# EAGLE design new-display (EAGLE 9.5.2)
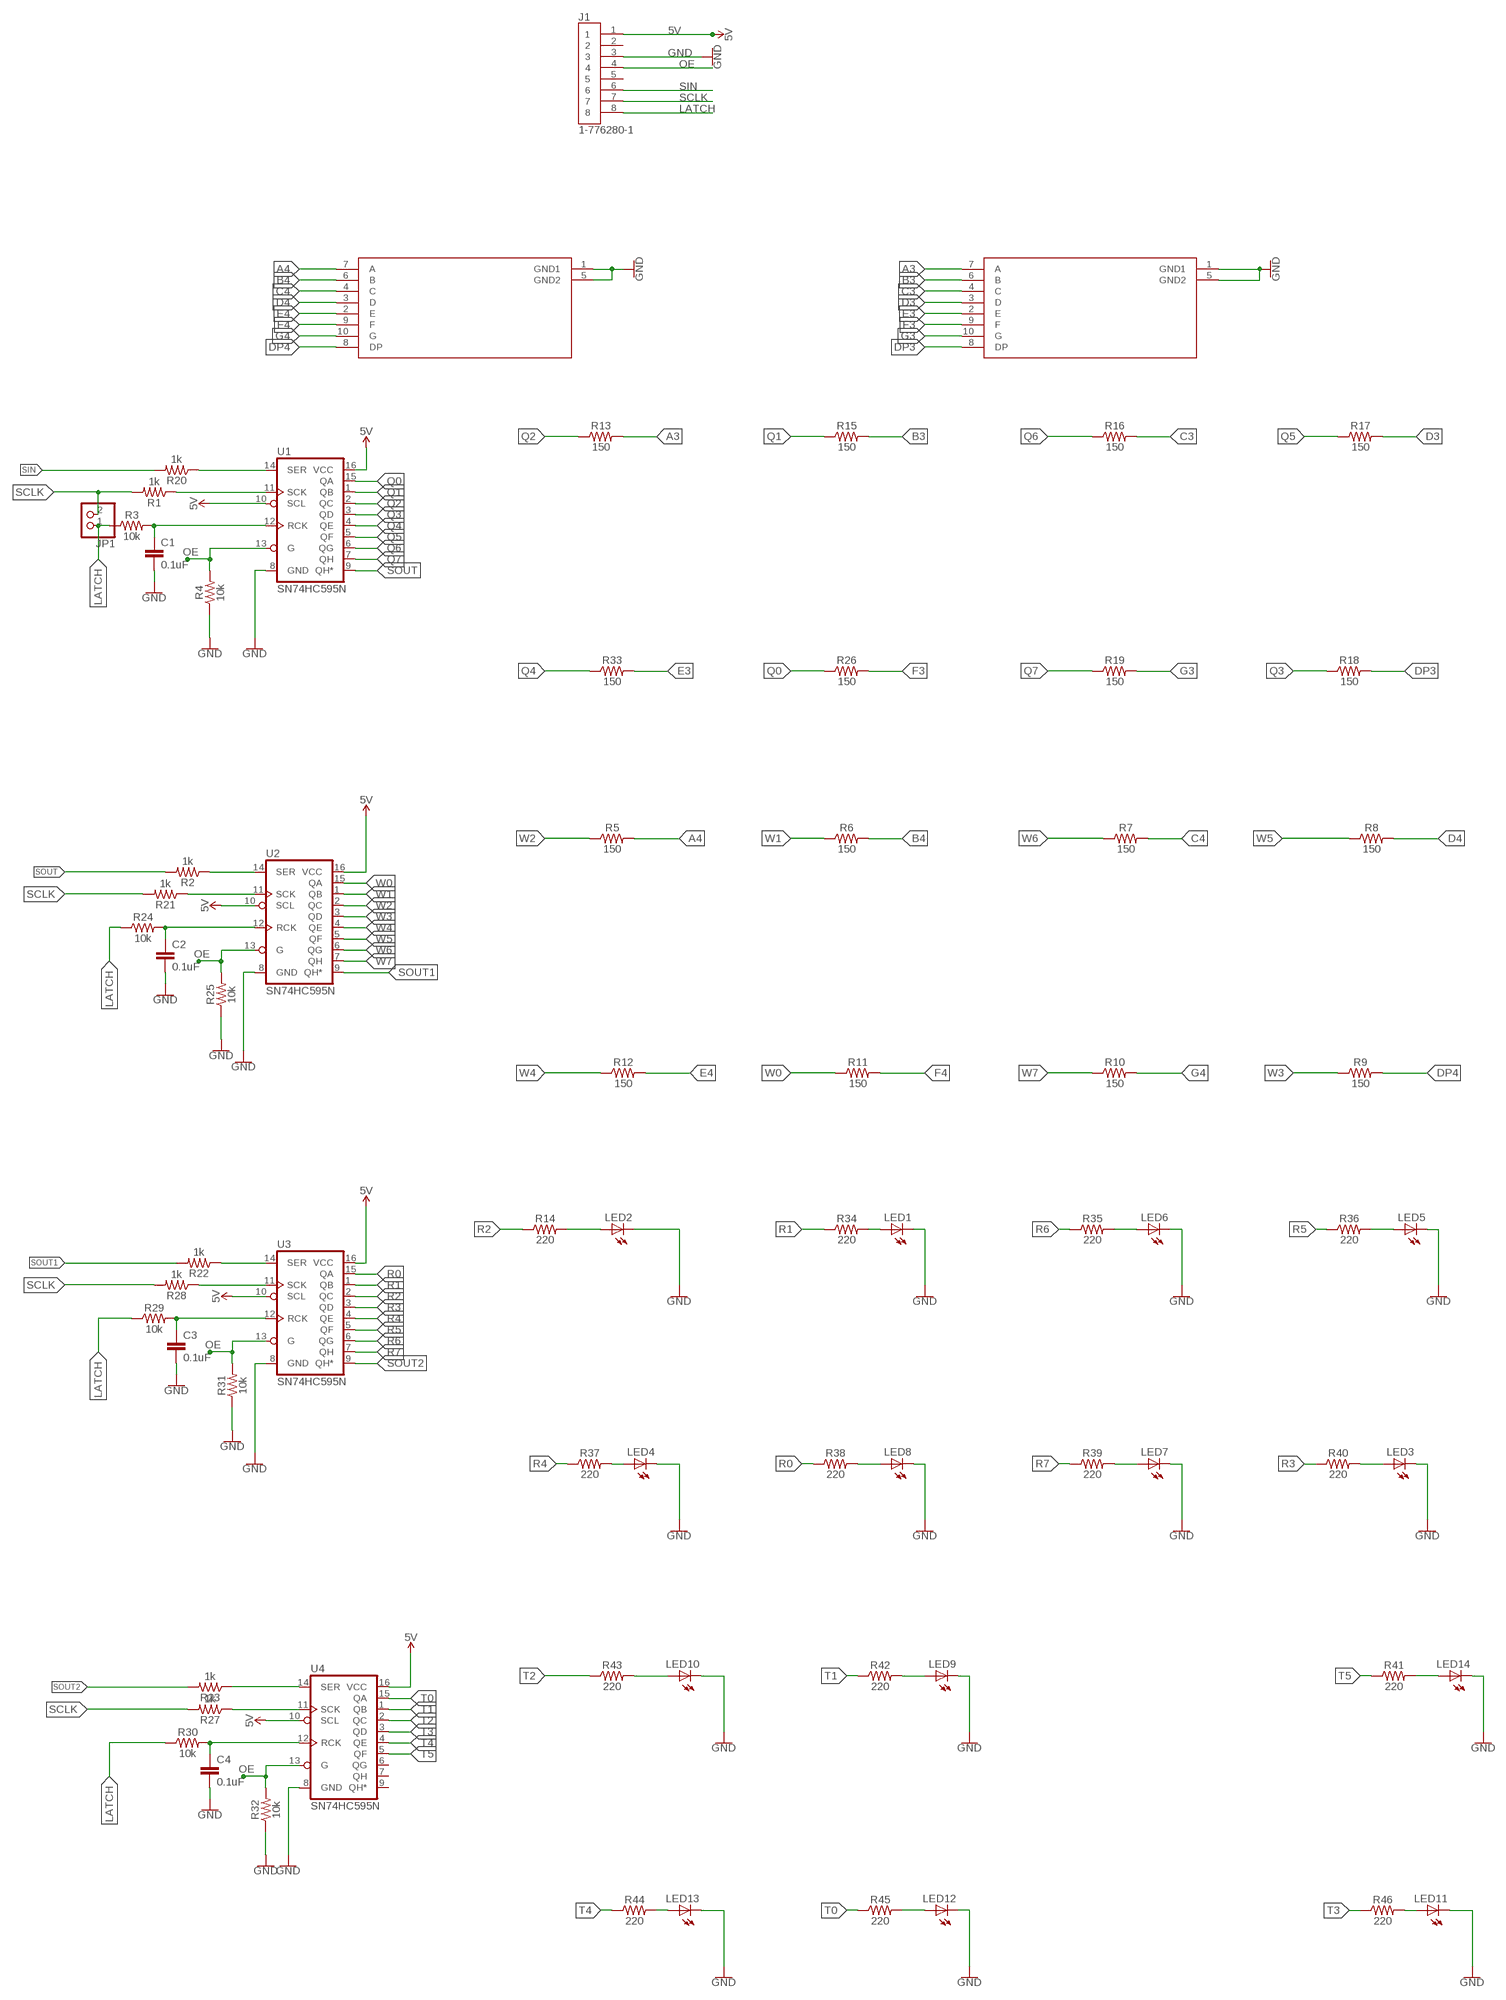
[diagram p0: schematic, sheet 1]

## Parts
C1  0.1uF  22PF-PTH-2.54MM-200V-5%  [CAP-PTH-2.54]
C2  0.1uF  22PF-PTH-2.54MM-200V-5%  [CAP-PTH-2.54]
C3  0.1uF  22PF-PTH-2.54MM-200V-5%  [CAP-PTH-2.54]
C4  0.1uF  22PF-PTH-2.54MM-200V-5%  [CAP-PTH-2.54]
J1  1-776280-1  [TE_1-776280-1]
JP1  PINHD-1X2  [1X02]
LED1  LED5MM  [LED5MM]
LED2  LED5MM  [LED5MM]
LED3  LED5MM  [LED5MM]
LED4  LED5MM  [LED5MM]
LED5  LED5MM  [LED5MM]
LED6  LED5MM  [LED5MM]
LED7  LED5MM  [LED5MM]
LED8  LED5MM  [LED5MM]
LED9  LED5MM  [LED5MM]
LED10  LED5MM  [LED5MM]
LED11  LED5MM  [LED5MM]
LED12  LED5MM  [LED5MM]
LED13  LED5MM  [LED5MM]
LED14  LED5MM  [LED5MM]
R1  1k  1KOHM-HORIZ-1/4W-5%  [AXIAL-0.3]
R2  1k  1KOHM-HORIZ-1/4W-5%  [AXIAL-0.3]
R3  10k  10KOHM-HORIZ-1/4W-5%  [AXIAL-0.3]
R4  10k  10KOHM-HORIZ-1/4W-5%  [AXIAL-0.3]
R5  150  10KOHM-HORIZ-1/4W-5%  [AXIAL-0.3]
R6  150  10KOHM-HORIZ-1/4W-5%  [AXIAL-0.3]
R7  150  10KOHM-HORIZ-1/4W-5%  [AXIAL-0.3]
R8  150  10KOHM-HORIZ-1/4W-5%  [AXIAL-0.3]
R9  150  10KOHM-HORIZ-1/4W-5%  [AXIAL-0.3]
R10  150  10KOHM-HORIZ-1/4W-5%  [AXIAL-0.3]
R11  150  10KOHM-HORIZ-1/4W-5%  [AXIAL-0.3]
R12  150  10KOHM-HORIZ-1/4W-5%  [AXIAL-0.3]
R13  150  10KOHM-HORIZ-1/4W-5%  [AXIAL-0.3]
R14  220  10KOHM-HORIZ-1/4W-5%  [AXIAL-0.3]
R15  150  10KOHM-HORIZ-1/4W-5%  [AXIAL-0.3]
R16  150  10KOHM-HORIZ-1/4W-5%  [AXIAL-0.3]
R17  150  10KOHM-HORIZ-1/4W-5%  [AXIAL-0.3]
R18  150  10KOHM-HORIZ-1/4W-5%  [AXIAL-0.3]
R19  150  10KOHM-HORIZ-1/4W-5%  [AXIAL-0.3]
R20  1k  1KOHM-HORIZ-1/4W-5%  [AXIAL-0.3]
R21  1k  1KOHM-HORIZ-1/4W-5%  [AXIAL-0.3]
R22  1k  1KOHM-HORIZ-1/4W-5%  [AXIAL-0.3]
R23  1k  1KOHM-HORIZ-1/4W-5%  [AXIAL-0.3]
R24  10k  10KOHM-HORIZ-1/4W-5%  [AXIAL-0.3]
R25  10k  10KOHM-HORIZ-1/4W-5%  [AXIAL-0.3]
R26  150  10KOHM-HORIZ-1/4W-5%  [AXIAL-0.3]
R27  1k  1KOHM-HORIZ-1/4W-5%  [AXIAL-0.3]
R28  1k  1KOHM-HORIZ-1/4W-5%  [AXIAL-0.3]
R29  10k  10KOHM-HORIZ-1/4W-5%  [AXIAL-0.3]
R30  10k  10KOHM-HORIZ-1/4W-5%  [AXIAL-0.3]
R31  10k  10KOHM-HORIZ-1/4W-5%  [AXIAL-0.3]
R32  10k  10KOHM-HORIZ-1/4W-5%  [AXIAL-0.3]
R33  150  10KOHM-HORIZ-1/4W-5%  [AXIAL-0.3]
R34  220  10KOHM-HORIZ-1/4W-5%  [AXIAL-0.3]
R35  220  10KOHM-HORIZ-1/4W-5%  [AXIAL-0.3]
R36  220  10KOHM-HORIZ-1/4W-5%  [AXIAL-0.3]
R37  220  10KOHM-HORIZ-1/4W-5%  [AXIAL-0.3]
R38  220  10KOHM-HORIZ-1/4W-5%  [AXIAL-0.3]
R39  220  10KOHM-HORIZ-1/4W-5%  [AXIAL-0.3]
R40  220  10KOHM-HORIZ-1/4W-5%  [AXIAL-0.3]
R41  220  10KOHM-HORIZ-1/4W-5%  [AXIAL-0.3]
R42  220  10KOHM-HORIZ-1/4W-5%  [AXIAL-0.3]
R43  220  10KOHM-HORIZ-1/4W-5%  [AXIAL-0.3]
R44  220  10KOHM-HORIZ-1/4W-5%  [AXIAL-0.3]
R45  220  10KOHM-HORIZ-1/4W-5%  [AXIAL-0.3]
R46  220  10KOHM-HORIZ-1/4W-5%  [AXIAL-0.3]
U1  SN74HC595N  74HC595N  [DIP16]
U2  SN74HC595N  74HC595N  [DIP16]
U3  SN74HC595N  74HC595N  [DIP16]
U4  SN74HC595N  74HC595N  [DIP16]
U$1  DISPLAY1.2  [1.2INCH]
U$2  DISPLAY1.2  [1.2INCH]

## Nets
5V: J1.1 U1.10(SCL) U1.16(VCC) U2.10(SCL) U2.16(VCC) U3.10(SCL) U3.16(VCC) U4.10(SCL) U4.16(VCC)
A3: R13.P$2 U$1.7(A)
A4: R5.P$2 U$2.7(A)
B3: R15.P$2 U$1.6(B)
B4: R6.P$2 U$2.6(B)
C3: R16.P$2 U$1.4(C)
C4: R7.P$2 U$2.4(C)
D3: R17.P$2 U$1.3(D)
D4: R8.P$2 U$2.3(D)
DP3: R18.P$2 U$1.8(DP)
DP4: R9.P$2 U$2.8(DP)
E3: R33.P$2 U$1.2(E)
E4: R12.P$2 U$2.2(E)
F3: R26.P$2 U$1.9(F)
F4: R11.P$2 U$2.9(F)
G3: R19.P$2 U$1.10(G)
G4: R10.P$2 U$2.10(G)
GND: C1.2 C2.2 C3.2 C4.2 J1.3 LED1.K(C) LED2.K(C) LED3.K(C) LED4.K(C) LED5.K(C) LED6.K(C) LED7.K(C) LED8.K(C) LED9.K(C) LED10.K(C) LED11.K(C) LED12.K(C) LED13.K(C) LED14.K(C) R4.P$1 R25.P$1 R31.P$1 R32.P$1 U1.8(GND) U2.8(GND) U3.8(GND) U4.8(GND) U$1.1(GND1) U$1.5(GND2) U$2.1(GND1) U$2.5(GND2)
LATCH: J1.8 JP1.1 R3.P$1 R24.P$1 R29.P$1 R30.P$1
N$1: R20.P$1 U1.14(SER)
N$2: R1.P$1 U1.11(SCK)
N$5: C1.1 R3.P$2 U1.12(RCK)
N$6: R2.P$1 U2.14(SER)
N$10: R21.P$1 U2.11(SCK)
N$18: C2.1 R24.P$2 U2.12(RCK)
N$32: LED4.A R37.P$2
N$33: LED8.A R38.P$2
N$34: LED7.A R39.P$2
N$35: LED3.A R40.P$2
N$36: LED5.A R36.P$2
N$37: LED6.A R35.P$2
N$38: LED1.A R34.P$2
N$39: LED2.A R14.P$2
N$40: LED10.A R43.P$2
N$41: R22.P$1 U3.14(SER)
N$42: R28.P$1 U3.11(SCK)
N$43: C3.1 R29.P$2 U3.12(RCK)
N$44: LED9.A R42.P$2
N$45: LED11.A R46.P$2
N$46: LED14.A R41.P$2
N$47: LED12.A R45.P$2
N$52: R23.P$1 U4.14(SER)
N$53: R27.P$1 U4.11(SCK)
N$54: C4.1 R30.P$2 U4.12(RCK)
N$58: LED13.A R44.P$2
OE: J1.4 R4.P$2 R25.P$2 R31.P$2 R32.P$2 U1.13(G) U2.13(G) U3.13(G) U4.13(G)
Q0: R26.P$1 U1.15(QA)
Q1: R15.P$1 U1.1(QB)
Q2: R13.P$1 U1.2(QC)
Q3: R18.P$1 U1.3(QD)
Q4: R33.P$1 U1.4(QE)
Q5: R17.P$1 U1.5(QF)
Q6: R16.P$1 U1.6(QG)
Q7: R19.P$1 U1.7(QH)
R0: R38.P$1 U3.15(QA)
R1: R34.P$1 U3.1(QB)
R2: R14.P$1 U3.2(QC)
R3: R40.P$1 U3.3(QD)
R4: R37.P$1 U3.4(QE)
R5: R36.P$1 U3.5(QF)
R6: R35.P$1 U3.6(QG)
R7: R39.P$1 U3.7(QH)
SCLK: J1.7 JP1.2 R1.P$2 R21.P$2 R27.P$2 R28.P$2
SIN: J1.6 R20.P$2
SOUT: R2.P$2 U1.9(QH*)
SOUT1: R22.P$2 U2.9(QH*)
SOUT2: R23.P$2 U3.9(QH*)
T0: R45.P$1 U4.15(QA)
T1: R42.P$1 U4.1(QB)
T2: R43.P$1 U4.2(QC)
T3: R46.P$1 U4.3(QD)
T4: R44.P$1 U4.4(QE)
T5: R41.P$1 U4.5(QF)
W0: R11.P$1 U2.15(QA)
W1: R6.P$1 U2.1(QB)
W2: R5.P$1 U2.2(QC)
W3: R9.P$1 U2.3(QD)
W4: R12.P$1 U2.4(QE)
W5: R8.P$1 U2.5(QF)
W6: R7.P$1 U2.6(QG)
W7: R10.P$1 U2.7(QH)
Unconnected: J1.2 J1.5 U4.6(QG) U4.7(QH) U4.9(QH*)

## Library data of the parts
C1-C4 = SparkFun-Capacitors:22PF: 22pF ceramic capacitors A capacitor is a passive two-terminal electrical component used to store electrical energy temporarily in an electric field.; PROD_ID: CAP-09128; VALUE: 22pF
J1 = 1-776280-1:1-776280-1: 8 POS RTANG HDR ASSY W/GASKET; MANUFACTURER: TE Connectivity; METADATA: Manufacturer recommendations; PARTREV: F8
JP1 = pinhead:PINHD-1X2: PIN HEADER
LED1-LED14 = adafruit:LED: LED OSRAM: - CHIPLED LG R971, LG N971, LY N971, LG Q971, LY Q971, LO R971, LY R971 LH N974, LH R974 LS Q976, LO Q976, LY Q976 LO Q996 - Hyper CHIPLED LW Q18S LB Q993, LB Q99A, LB R99A - SideLED LS A670, LO A670, LY A670, LG A670, LP A670 LB A673, LV A673, LT A673, LW A673 LH A674 LY A675 LS A676, LA A676, LO A676, LY A676, LW A676 LS A679, LY A679, LG A679 - Hyper Micro SIDELED® LS Y876, LA Y876, LO Y876, LY Y876 LT Y87S - SmartLED LW L88C, LW L88S LB L89C, LB L89S, LG L890 LS L89K, LO L89K, LY L89K LS L896, LA L896, LO L896, LY L896 - TOPLED LS T670, LO T670, LY T670, LG T670, LP T670 LSG T670, LSP T670, LSY T670, LOP T670, LYG T670 LG T671, LOG T671, LSG T671 LB T673, LV T673, LT T673, LW T673 LH T674 LS T676, LA T676, LO T676, LY T676, LB T676, LH T676, LSB T676, LW T676 LB T67C, LV T67C, LT T67C, LS T67K, LO T67K, LY T67K, LW E67C LS E67B, LA E67B, LO E67B, LY E67B, LB E67C, LV E67C, LT E67C LW T67C LS T679, LY T679, LG T679 LS T770, LO T770, LY T770, LG T770, LP T770 LB T773, LV T773, LT T773, LW T773 LH T774 LS E675, LA E675, LY E675, LS T675 LS T776, LA T776, LO T776, LY T776, LB T776 LHGB T686 LT T68C, LB T68C - Hyper Mini TOPLED® LB M676 - Mini TOPLED Santana® LG M470 LS M47K, LO M47K, LY M47K Source: http://www.osram.convergy.de/
R1 R2 R20-R23 R27 R28 = SparkFun-Resistors:1KOHM: 1kΩ resistor A resistor is a passive two-terminal electrical component that implements electrical resistance as a circuit element. Resistors act to reduce current flow, and, at the same time, act to lower voltage levels within circuits. - Wikipedia; PROD_ID: RES-08380
R3 R4 R24 R25 R29-R32 = SparkFun-Resistors:10KOHM: 10kΩ resistor A resistor is a passive two-terminal electrical component that implements electrical resistance as a circuit element. Resistors act to reduce current flow, and, at the same time, act to lower voltage levels within circuits. - Wikipedia; PROD_ID: RES-09435
R5-R19 R26 R33-R46 = SparkFun-Resistors:10KOHM: 10kΩ resistor A resistor is a passive two-terminal electrical component that implements electrical resistance as a circuit element. Resistors act to reduce current flow, and, at the same time, act to lower voltage levels within circuits. - Wikipedia; PROD_ID: RES-09435; VALUE: 10k
U1-U4 = SparkFun-IC-Logic:74*595: 8-Bit Shift Register (Serial to Parallel) Datasheet <http://cdn.sparkfun.com/datasheets/BreakoutBoards/MM74HC595.pdf> SparkFun Products SparkFun Shift Register Breakout - 74HC595 <https://www.sparkfun.com/products/10680> (BOB-10680); PROD_ID: IC-13123
U$1 U$2 = displays-vigs:DISPLAY1.2

## Net classes
0 default: width 0.31 mm

## Board
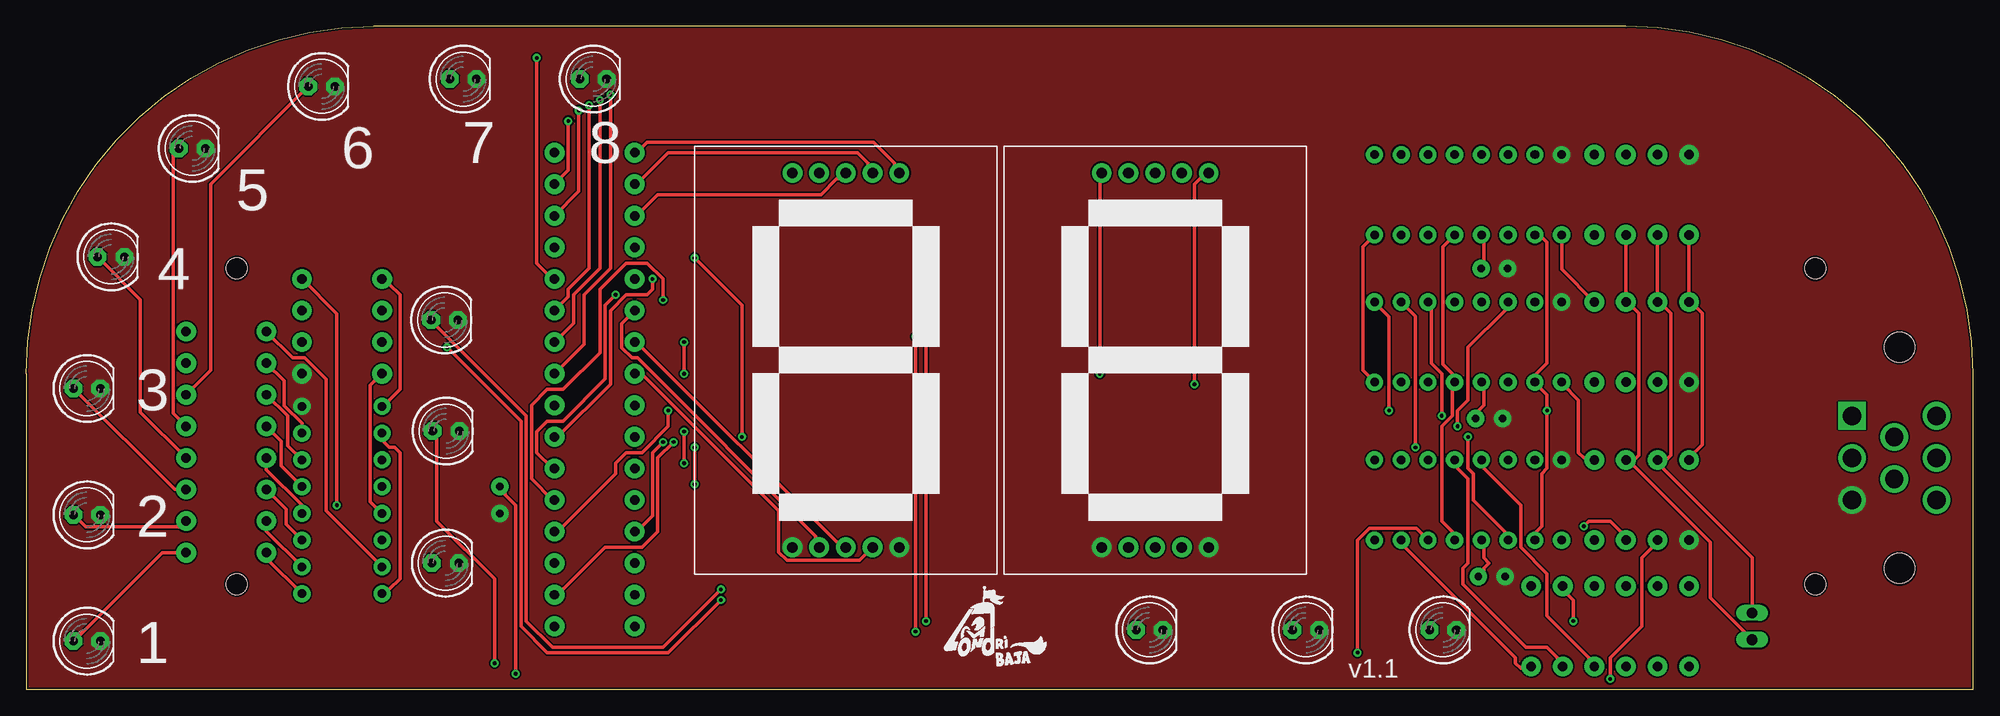
[diagram p1: board, top side]
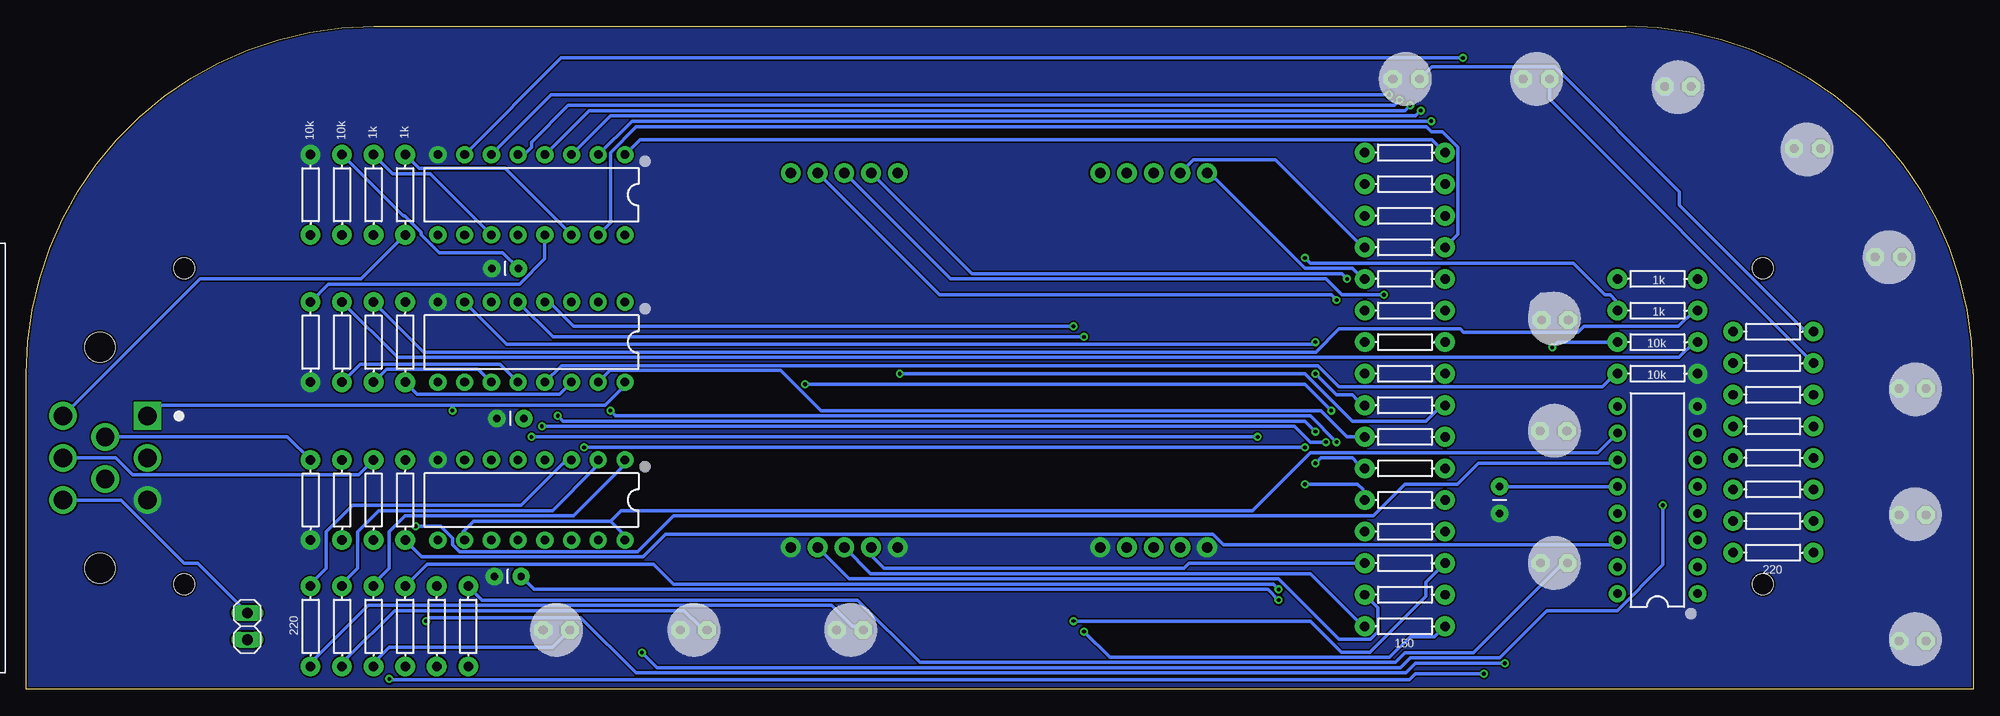
[diagram p2: board, bottom side, seen from below]

Size 185 x 63 mm. Coordinates in mm from the lower left corner, seen from the top.
Outline: 0,0 185,0 185,30 arc90 152,63 33,63 arc90 0,30 0,0
Copper layers (1*16): Top 0.035mm / dielectric 1.5mm / Bottom 0.035mm
Design rules "default *": minimum track width 6mil, minimum drill 0.35mm, track to track 6mil, track to pad 6mil, pad to pad 6mil, via to via 6mil, smd to smd 6mil, copper to edge 0.2mm, drill to drill 6mil, minimum pad ring 10mil, minimum via ring 8mil, stop-mask expansion 4mil, vias tented up to drill 0mil, thermal gap 10mil
Holes 2 mm at 20,10 20,40 170,10 170,40

### Footprints (pad centres in the part's own frame; a part is rotated, then mirrored left to right if it is on the bottom)
CAP-PTH-2.54 = drill 0.7 pad 1.651: 1 -1.27,0; 2 1.27,0
TE_1-776280-1 = drill 1.75 square: 1 -4,4.5 | drill 1.75: 2 0,4.5; 3 4,4.5; 4 -2,0.5; 5 2,0.5; 6 -4,-3.5; 7 0,-3.5; 8 4,-3.5 | hole 2.85: -10.5,0; 10.5,0
1X02 = drill 1.016 long: 1 -1.27,0; 2 1.27,0
LED5MM = drill 0.813 pad 1.676 octagon: A -1.27,0; K 1.27,0
AXIAL-0.3 = drill 0.9 pad 1.88: P$1 -3.81,0; P$2 3.81,0
DIP16 = drill 0.813 pad 1.626: 1 -8.89,-3.81; 2 -6.35,-3.81; 3 -3.81,-3.81; 4 -1.27,-3.81; 5 1.27,-3.81; 6 3.81,-3.81; 7 6.35,-3.81; 8 8.89,-3.81; 9 8.89,3.81; 10 6.35,3.81; 11 3.81,3.81; 12 1.27,3.81; 13 -1.27,3.81; 14 -3.81,3.81; 15 -6.35,3.81; 16 -8.89,3.81
1.2INCH = drill 1 pad 1.88: 1 -5.08,-17.78; 2 -2.54,-17.78; 3 0,-17.78; 4 2.54,-17.78; 5 5.08,-17.78; 6 5.08,17.78; 7 2.54,17.78; 8 0,17.78; 9 -2.54,17.78; 10 -5.08,17.78

### Placement (x,y rotation side)
C1  139.5,40 180 bottom
C2  139,25.75 180 bottom
C3  45,18 270 bottom
C4  139.25,10.75 180 bottom
J1  178,22 270 bottom
JP1  164,6 270 bottom
LED1  5.76,4.59 0 top
LED2  5.76,16.59 0 top
LED3  5.76,28.59 0 top
LED4  8.05,41.1 0 top
LED5  15.76,51.4 0 top
LED6  28.06,57.29 0 top
LED7  41.51,57.99 0 top
LED8  53.87,57.99 0 top
LED9  134.62,5.66 0 top
LED10  121.58,5.66 0 top
LED11  106.74,5.66 0 top
LED12  39.82,12 0 top
LED13  39.88,24.55 0 top
LED14  39.74,35.1 0 top
R1  152,47 270 bottom
R2  149,33 90 bottom
R3  155,47 90 bottom
R4  158,47 270 bottom
R5  54,18 0 bottom
R6  54,15 0 bottom
R7  54,9 180 bottom
R8  54,6 180 bottom
R9  54,21 0 bottom
R10  54,27 0 bottom
R11  54,24 0 bottom
R12  54,12 180 bottom
R13  54,48 180 bottom
R14  19,16 0 bottom
R15  54,51 180 bottom
R16  54,30 180 bottom
R17  54,33 180 bottom
R18  54,45 180 bottom
R19  54,39 180 bottom
R20  149,47 270 bottom
R21  152,33 90 bottom
R22  149,18 90 bottom
R23  30,39 180 bottom
R24  155,33 270 bottom
R25  158,33 90 bottom
R26  54,42 180 bottom
R27  30,36 0 bottom
R28  152,18 90 bottom
R29  155,18 270 bottom
R30  30,33 180 bottom
R31  158,18 90 bottom
R32  30,30 180 bottom
R33  54,36 180 bottom
R34  19,13 0 bottom
R35  19,28 0 bottom
R36  19,25 0 bottom
R37  19,22 0 bottom
R38  19,34 0 bottom
R39  19,31 0 bottom
R40  19,19 0 bottom
R41  149,6 90 bottom
R42  152,6 270 bottom
R43  155,6 270 bottom
R44  146,6 90 bottom
R45  143,6 90 bottom
R46  158,6 270 bottom
U1  137,47 180 bottom
U2  137,33 180 bottom
U3  30,18 90 bottom
U4  137,18 180 bottom
U$1  77.88,31.29 0 top
U$2  107.27,31.29 0 top

### Tracks (layer width: path | path; a pad name or v marks a point on that pad's centre or on a via)
5V  (via drill 0.35)
  Top 0.31: U3.16 34,9.5 34.5,9.5 35.5,10.5 35.5,22.5 35,23 34.5,23 34,23.5 34,24 U3.10 | U1.10 143.5,43.5 144.5,42.5 144.5,31 143.5,30 143.5,29.5 U2.10 143.5,29 144.5,28 v144.5,26.5 144.5,21 144,20.5 144,15.5 143.5,15 143.5,14.5 U4.10 | U1.16 126.99,42.07 126.99,30.31 U2.16
  Bottom 0.31: J1.1 172.5,27 144.5,27 | 144.5,27 130,27 128.5,28.5 128,28.5 127.5,29 128,29.5 U2.16 | 129.5,16 128.5,15 128.5,14.5 U4.16 | 129.5,16 142.5,16 143.5,15 143.5,14.5 U4.10 | 129.5,16 128.5,17 68.5,17 63,22.5 35.66,22.5 U3.10 | v144.5,26.5 144.5,27
A3
  Top 0.31: R13.P$2 58,48 61,51 79,51 80,50 80,49.5 U$1.7
A4  (via drill 0.35)
  Top 0.31: v60.5,37 60.5,39 59,40.5 57,40.5 54.5,38 54.5,32 51,28.5 49.5,28.5 48,27 48,20 50,18 R5.P$2
  Bottom 0.31: v60.5,37 61,37.5 98.24,37.5 U$2.7
B3
  Top 0.31: R15.P$2 58,51 59,52 80.5,52 82.5,50 82.5,49.5 U$1.6
B4  (via drill 0.35)
  Top 0.31: v61,26.5 61,25 58.5,22.5 57,22.5 56,21.5 56,20.5 50.5,15 R6.P$2 | v111,29 111,48 111.5,48.5 112,48.5 112,49 U$2.6
  Bottom 0.31: v61,26.5 63.5,29 v111,29
C3
  Top 0.31: U$1.4 79.17,12.26 72.28,12.26 71.5,13.05 71.5,16.97 58.47,30 R16.P$2
C4
  Bottom 0.31: R7.P$2 56.56,7.75 56.56,5.48 57.29,4.75 60.25,4.75 66,10.5 106.8,10.5 U$2.4
D3
  Top 0.31: R17.P$2 58,33 77.49,13.51 U$1.3
D4
  Bottom 0.31: R8.P$2 58,6 63,11 104.76,11 U$2.3
DP3
  Top 0.31: R18.P$2 58,45 60,47 75.5,47 77,48.5 77.5,48.5 77.5,49 U$1.8
DP4  (via drill 0.35)
  Top 0.31: v56,37.5 55,36.5 55,29.5 51,25.5 49.5,25.5 48.5,24.5 48.5,22.5 50,21 R9.P$2
  Bottom 0.31: v56,37.5 60,37.5 61.5,39 97.2,39 U$2.8
E3
  Top 0.31: U$1.2 75,13.85 75,14.57 58.07,31.5 57.55,31.5 56.56,32.48 56.56,34.75 R33.P$2
E4
  Bottom 0.31: R12.P$2 74.5,12 75,11.5 103.5,11.5 104.5,12.5 104.5,13.5 U$2.2
F3
  Bottom 0.31: R26.P$2 58,42 66.32,50.32 74.09,50.32 U$1.9
F4  (via drill 0.35)
  Top 0.31: v59.5,39 59.5,38 59,37.5 57,37.5 55.5,36 55.5,29 50.5,24 R11.P$2
  Bottom 0.31: v59.5,39 60,39.5 95.16,39.5 U$2.9
G3
  Bottom 0.31: R19.P$2 58,39 59,40 63.5,40 72,48.5 72.5,48.5 73,49 U$1.10
G4  (via drill 0.35)
  Top 0.31: v102,30 102,49 U$2.10
  Bottom 0.31: v102,30 63.5,30 59,25.5 52,25.5 50.5,27 R10.P$2
GND
  pour Top (no thermals): 0,0 0,30 arc-90 33,63 152,63 arc-90 185,30 185,0
  pour Bottom (rank 6, no thermals): 0,0 0,30 arc-90 33,63 152,63 arc-90 185,30 185,0
LATCH
  Top 0.31: JP1.1 164,12.5 155.5,21 155.5,21.5 | 155.5,21.5 155,22 R29.P$1 155.5,21.5 | 155,37 R3.P$1 | 155,37 R24.P$1 | 155.5,21.5 156.25,22.25 156.25,35.75 155,37
  Bottom 0.31: J1.8 176,18 170,12 168.73,12 JP1.1 | R30.P$1 26.5,33 27.96,31.54 149.73,31.54 R24.P$1
N$1
  Bottom 0.31: R20.P$1 147.69,49.5 139.5,49.5 U1.14
N$2
  Bottom 0.31: R1.P$1 150.19,49 146.62,49 U1.11
N$5
  Top 0.31: U1.12 138.5,43 138.5,40 C1.1
  Bottom 0.31: R3.P$2 149.19,45 149.05,45 147.5,43.45 147.5,43.22 145.78,41.5 139.73,41.5 C1.1
N$6
  Bottom 0.31: R2.P$1 147.88,28.07 134.31,28.07 U2.14
N$10
  Bottom 0.31: R21.P$1 150.75,30.44 142.06,30.44 U2.11
N$18
  Top 0.31: U2.12 138.5,29 138.5,27 138,26.5 138,26 C2.1
  Bottom 0.31: R24.P$2 153.29,30.9 139.98,30.9 U2.12
N$32
  Top 0.31: LED4.A 10.84,37.04 10.84,26.35 R37.P$2
N$33
  Bottom 0.31: LED8.A 51.45,59.14 39.77,59.14 27.93,47.3 27.93,46.02 15.92,34 R38.P$2
N$34
  Bottom 0.31: LED7.A 40.24,56.05 R39.P$2
N$35
  Top 0.31: LED3.A 14.08,19 R40.P$2
N$36
  Top 0.31: LED5.A 13.94,50.85 13.94,26.25 R36.P$2
N$37
  Top 0.31: LED6.A 17.5,48 17.5,30.31 R35.P$2
N$38
  Top 0.31: R34.P$2 12.9,13 LED1.A
N$39
  Top 0.31: R14.P$2 14.63,15.44 5.63,15.44 LED2.A
N$40
  Bottom 0.31: LED10.A 120.5,6 121,6 122.5,7.5 150,7.5 154.5,3 154.5,2.5 155,2.5 R43.P$2
N$41
  Bottom 0.31: R22.P$1 147.42,12.61 126.39,12.61 124.24,14.76 72.26,14.76 71.25,13.75 34.25,13.75 U3.14
N$42  (via drill 0.35)
  Top 0.31: v148,15.5 148.5,16 150.5,16 151.5,15 151.5,14.5 152,14 R28.P$1
  Bottom 0.31: U3.11 34.12,21.5 47,21.5 49,19.5 54,19.5 57,16.5 123.5,16.5 126.93,13.07 143.81,13.07 144.5,13.76 144.5,14.38 145.62,15.5 v148,15.5
N$43  (via drill 0.35)
  Top 0.31: v150.5,1 150.5,3 153.5,6 153.5,12.5 155,14 R29.P$2 | v46.5,1.5 46.5,17.5 45.5,18.5 45.5,19 45,19.5 C3.1
  Bottom 0.31: v46.5,1.5 53,1.5 53.56,0.94 150.44,0.94 v150.5,1 | C3.1 U3.12
N$44
  Bottom 0.31: LED9.A 133.5,5.5 135,4 150.5,4 151.5,3 151.5,2.5 152,2.5 R42.P$2
N$45
  Bottom 0.31: LED11.A 105.5,6 106.5,6 108.5,8 152.5,8 157.5,3 157.5,2.5 158,2.5 R46.P$2
N$46  (via drill 0.35)
  Top 0.31: v66,9.5 60.5,4 50,4 47.5,6.5 47.5,26 38.5,35 LED14.A
  Bottom 0.31: v66,9.5 66.5,10 123.5,10 125.38,11.88 146.93,11.88 R41.P$2
N$47
  Bottom 0.31: LED12.A 39,12 47.5,3.5 54,3.5 54.92,2.58 100.08,2.58 106,8.5 141.69,8.5 R45.P$2
N$52  (via drill 0.35)
  Top 0.31: v29.5,17.5 29.5,35.69 R23.P$1 | v126.5,3.5 126.5,14.16 127.65,15.31 132.07,15.31 U4.14
  Bottom 0.31: v29.5,17.5 29.5,11.84 33.84,7.5 40.5,7.5 45,3 53.5,3 54.42,2.08 125.08,2.08 v126.5,3.5
N$53  (via drill 0.35)
  Top 0.31: v137,24 137,21 137.5,20.5 137.5,18 140.5,15 140.5,14.5 U4.11 | v68,24 68,36.5 v63.5,41
  Bottom 0.31: v68,24 v137,24 | v63.5,41 63,40.5 38,40.5 35,37.5 34.5,37.5 34,37 34,36 R27.P$1
N$54  (via drill 0.35)
  Top 0.31: U4.12 138.5,14 138.5,12.5 139,12 138.5,11.5 138.5,11 138,10.5 C4.1 | v40,32.5 47,25.5 47,6 49.5,3.5 61,3.5 v66,8.5
  Bottom 0.31: R30.P$2 39.5,33 v40,32.5 | v66,8.5 67,9.5 136.73,9.5 C4.1
N$58  (via drill 0.35)
  Top 0.31: v44.5,2.5 44.5,10.5 39,16 39,24.5 LED13.A | v147,6.5 147,8.5 146.5,9 146.5,9.5 146,10 R44.P$2
  Bottom 0.31: v44.5,2.5 53,2.5 53.92,1.57 127.08,1.57 132.31,6.81 146.69,6.81 v147,6.5
OE
  Top 0.31: R31.P$2 158,22 159.25,23.25 159.25,35.75 158,37 | 158,37 R4.P$2 | 158,37 R25.P$2 | U4.13 135.5,14.5 135.5,15 134.5,16 134.5,25 135.5,26 135.5,29 U2.13 135.5,29.42 135.5,30 134.61,30.89 134.61,42.07 U1.13 | R32.P$2 32.69,28.88 32.69,17.85 U3.13
  Bottom 0.31: R32.P$2 34,30 35.25,28.75 60.25,28.75 62.27,30.77 134.15,30.77 U2.13 | R31.P$2 160.19,24 J1.4 | U1.13 135.73,40.9 138.13,38.5 156.31,38.5 R25.P$2
Q0
  Bottom 0.31: R26.P$1 48.94,43.25 48.94,51.52 50.43,53 51.5,53 51.96,53.46 127.04,53.46 129.5,51 129.5,44.34 U1.15
Q1
  Bottom 0.31: R15.P$1 51.44,52.25 126.67,52.25 U1.1
Q2  (via drill 0.35)
  Top 0.31: v51.5,54 51.5,49.31 R13.P$1
  Bottom 0.31: v51.5,54 127.46,54 U1.2
Q3  (via drill 0.35)
  Top 0.31: v52.5,55 52.5,47.31 R18.P$1
  Bottom 0.31: U1.3 129.5,54.5 53,54.5 v52.5,55
Q4  (via drill 0.35)
  Top 0.31: v53.5,55.5 53.5,40 51.5,38 51.5,37.31 R33.P$1
  Bottom 0.31: v53.5,55.5 54,55 131.5,55 135.69,50.81 U1.4
Q5  (via drill 0.35)
  Top 0.31: v54.5,56 54.5,40 52,37.5 52,34.81 R17.P$1
  Bottom 0.31: v54.5,56 55,55.5 133.5,55.5 137,52 137,51.5 137.5,51 138,51 U1.5
Q6  (via drill 0.35)
  Top 0.31: v55.5,56.5 55.5,40 53,37.5 53,32.81 R16.P$1
  Bottom 0.31: v55.5,56.5 135.12,56.5 U1.6
Q7  (via drill 0.35)
  Top 0.31: v48.5,60 48.5,40.5 49.5,39.5 50,39.5 50,39 R19.P$1
  Bottom 0.31: v48.5,60 134.16,60 U1.7
R0
  Top 0.31: R38.P$1 25.31,31.5 26.45,31.5 28.5,29.45 28.5,16.96 U3.15
R1
  Top 0.31: R34.P$1 22.81,12.49 U3.1
R2
  Top 0.31: R14.P$1 22.81,15.03 U3.2
R3
  Top 0.31: R40.P$1 24.68,17.13 24.68,15.7 U3.3
R4
  Top 0.31: R37.P$1 22.81,20.89 26.19,17.51 U3.4
R5
  Top 0.31: R36.P$1 24.21,23.59 24.21,21.25 U3.5
R6
  Top 0.31: R35.P$1 24.82,25.99 24.82,23.18 U3.6
R7
  Top 0.31: R39.P$1 24.5,29.31 24.5,26.96 26.19,25.27 U3.7
SCLK
  Top 0.31: 152.5,21.5 152,22 R28.P$2 152.5,21.5 | 152,37 R1.P$2 | 152,37 R21.P$2 | 152.5,21.5 160,14 160,8.73 JP1.2 | 152.5,21.5 153.25,22.25 153.25,35.75 152,37
  Bottom 0.31: J1.7 176.5,22 174.88,20.38 153.43,20.38 R28.P$2 | R27.P$2 26.5,36 28,34.5 37,34.5 37.55,33.95 48.45,33.95 48.75,34.25 60.25,34.25 62.46,32.04 147.23,32.04 R21.P$2
SIN
  Bottom 0.31: R20.P$2 153.19,39 168.5,39 J1.6
SOUT
  Top 0.31: R2.P$2 145.89,39.92 U1.9
SOUT1
  Top 0.31: U2.9 146,29 147.5,27.5 147.5,22.5 148,22 149,22 R22.P$2
SOUT2
  Top 0.31: U3.9 34,27 35.5,28.5 35.5,37.5 34.5,38.5 34,38.5 34,39 R23.P$2
T0
  Top 0.31: U4.15 131,14 131,13.5 141.5,3 141.5,2.5 142,2 143,2 R45.P$1
T1
  Bottom 0.31: U4.1 128.5,21.5 128.5,21 133,16.5 149,16.5 150.5,15 150.5,11.5 151.5,10.5 151.5,10 152,10 R42.P$1
T2
  Bottom 0.31: U4.2 131,21.5 131,21 135,17 151.5,17 153.5,15 153.5,11.5 154.5,10.5 154.5,10 155,10 R43.P$1
T3
  Bottom 0.31: U4.3 133.5,21.5 134,21.5 138,17.5 154,17.5 156.5,15 156.5,11.5 157.5,10.5 157.5,10 158,10 R46.P$1
T4
  Top 0.31: U4.4 136,21.5 136,21 137,20 137,12 136.5,11.5 136.5,10 142.5,4 144.5,4 145.5,3 145.5,2.5 146,2 R44.P$1
T5
  Top 0.31: U4.5 138.5,21.5 138.5,21 142,17.5 142,13.5 144.5,11 144.5,7 148.5,3 148.5,2.5 149,2 R41.P$1
W0
  Bottom 0.31: U2.15 129.53,30.31 113.31,30.31 109.5,26.5 62,26.5 59.5,24 R11.P$1
W1  (via drill 0.35)
  Top 0.31: v60.5,23.5 59.5,22.5 59.5,16.5 58.5,15.5 58,15.5 58,15 R6.P$1 | v129.5,26.5 129.5,35.42 U2.1
  Bottom 0.31: v129.5,26.5 129,26 63,26 v60.5,23.5
W2  (via drill 0.35)
  Top 0.31: v63.5,19.5 v63.5,23 | v132,23 132,35.46 U2.2
  Bottom 0.31: v63.5,19.5 58.5,19.5 58,19 58,18 R5.P$1 | v63.5,23 v132,23
W3  (via drill 0.35)
  Top 0.31: v134.5,26 134.5,30 133.5,31 133.5,36.5 U2.3 | v62.5,21.5 v62.5,24.5
  Bottom 0.31: v134.5,26 134,25.5 63.5,25.5 v62.5,24.5 | v62.5,21.5 62,22 59,22 58.5,21.5 58.5,21 R9.P$1
W4  (via drill 0.35)
  Top 0.31: v85.5,6.5 v85.5,34.5
  Bottom 0.31: v85.5,34.5 133,34.5 135,36.5 135.5,36.5 U2.4 | v85.5,6.5 63,6.5 60.04,3.54 57.31,3.54 52,8.85 52,10.19 R12.P$1
W5  (via drill 0.35)
  Top 0.31: v84.5,5.5 v84.5,33.5
  Bottom 0.31: R8.P$1 51.19,5 53.5,5 55.46,3.04 82.04,3.04 v84.5,5.5 | v84.5,33.5 134.96,33.5 U2.5
W6  (via drill 0.35)
  Top 0.31: v136,25 136,26.5 137,27.5 137,32.5 140.5,36 140.5,36.5 U2.6 | v61.5,23.5 60,22 60,15 58.5,13.5 55,13.5 51,9.5 50.5,9.5 50.5,9 R7.P$1
  Bottom 0.31: v136,25 64.5,25 63,23.5 v61.5,23.5
W7  (via drill 0.35)
  Top 0.31: v62.5,30 v62.5,33
  Bottom 0.31: v62.5,30 60.5,28 59,28 58.5,27.5 58.5,27 R10.P$1 | v62.5,33 62.69,32.81 139.35,32.81 U2.7

### Text on the board
tPlace: 6 | 7 | 8 | 5 | 4 | 3 | 2 | 1 | v1.1
bPlace: 1k | 1k | 10k | 10k | 1k | 1k | 10k | 10k | 220 | 220 | 150